# EasyEDA Pro project ProDocument_LN_CTRL_V1_2026-03-25.epro, schematic Schematic1, sheets 1 to 3 of 5

## Sheets
1 README: Create Date: 2025-09-18; Page Name: README; Project Name: 偏控器件; Schematic Name: Schematic1; Update Date: 2025-09-26; Company: 嘉立创EDA; Page Size: A4; Version: V1.0
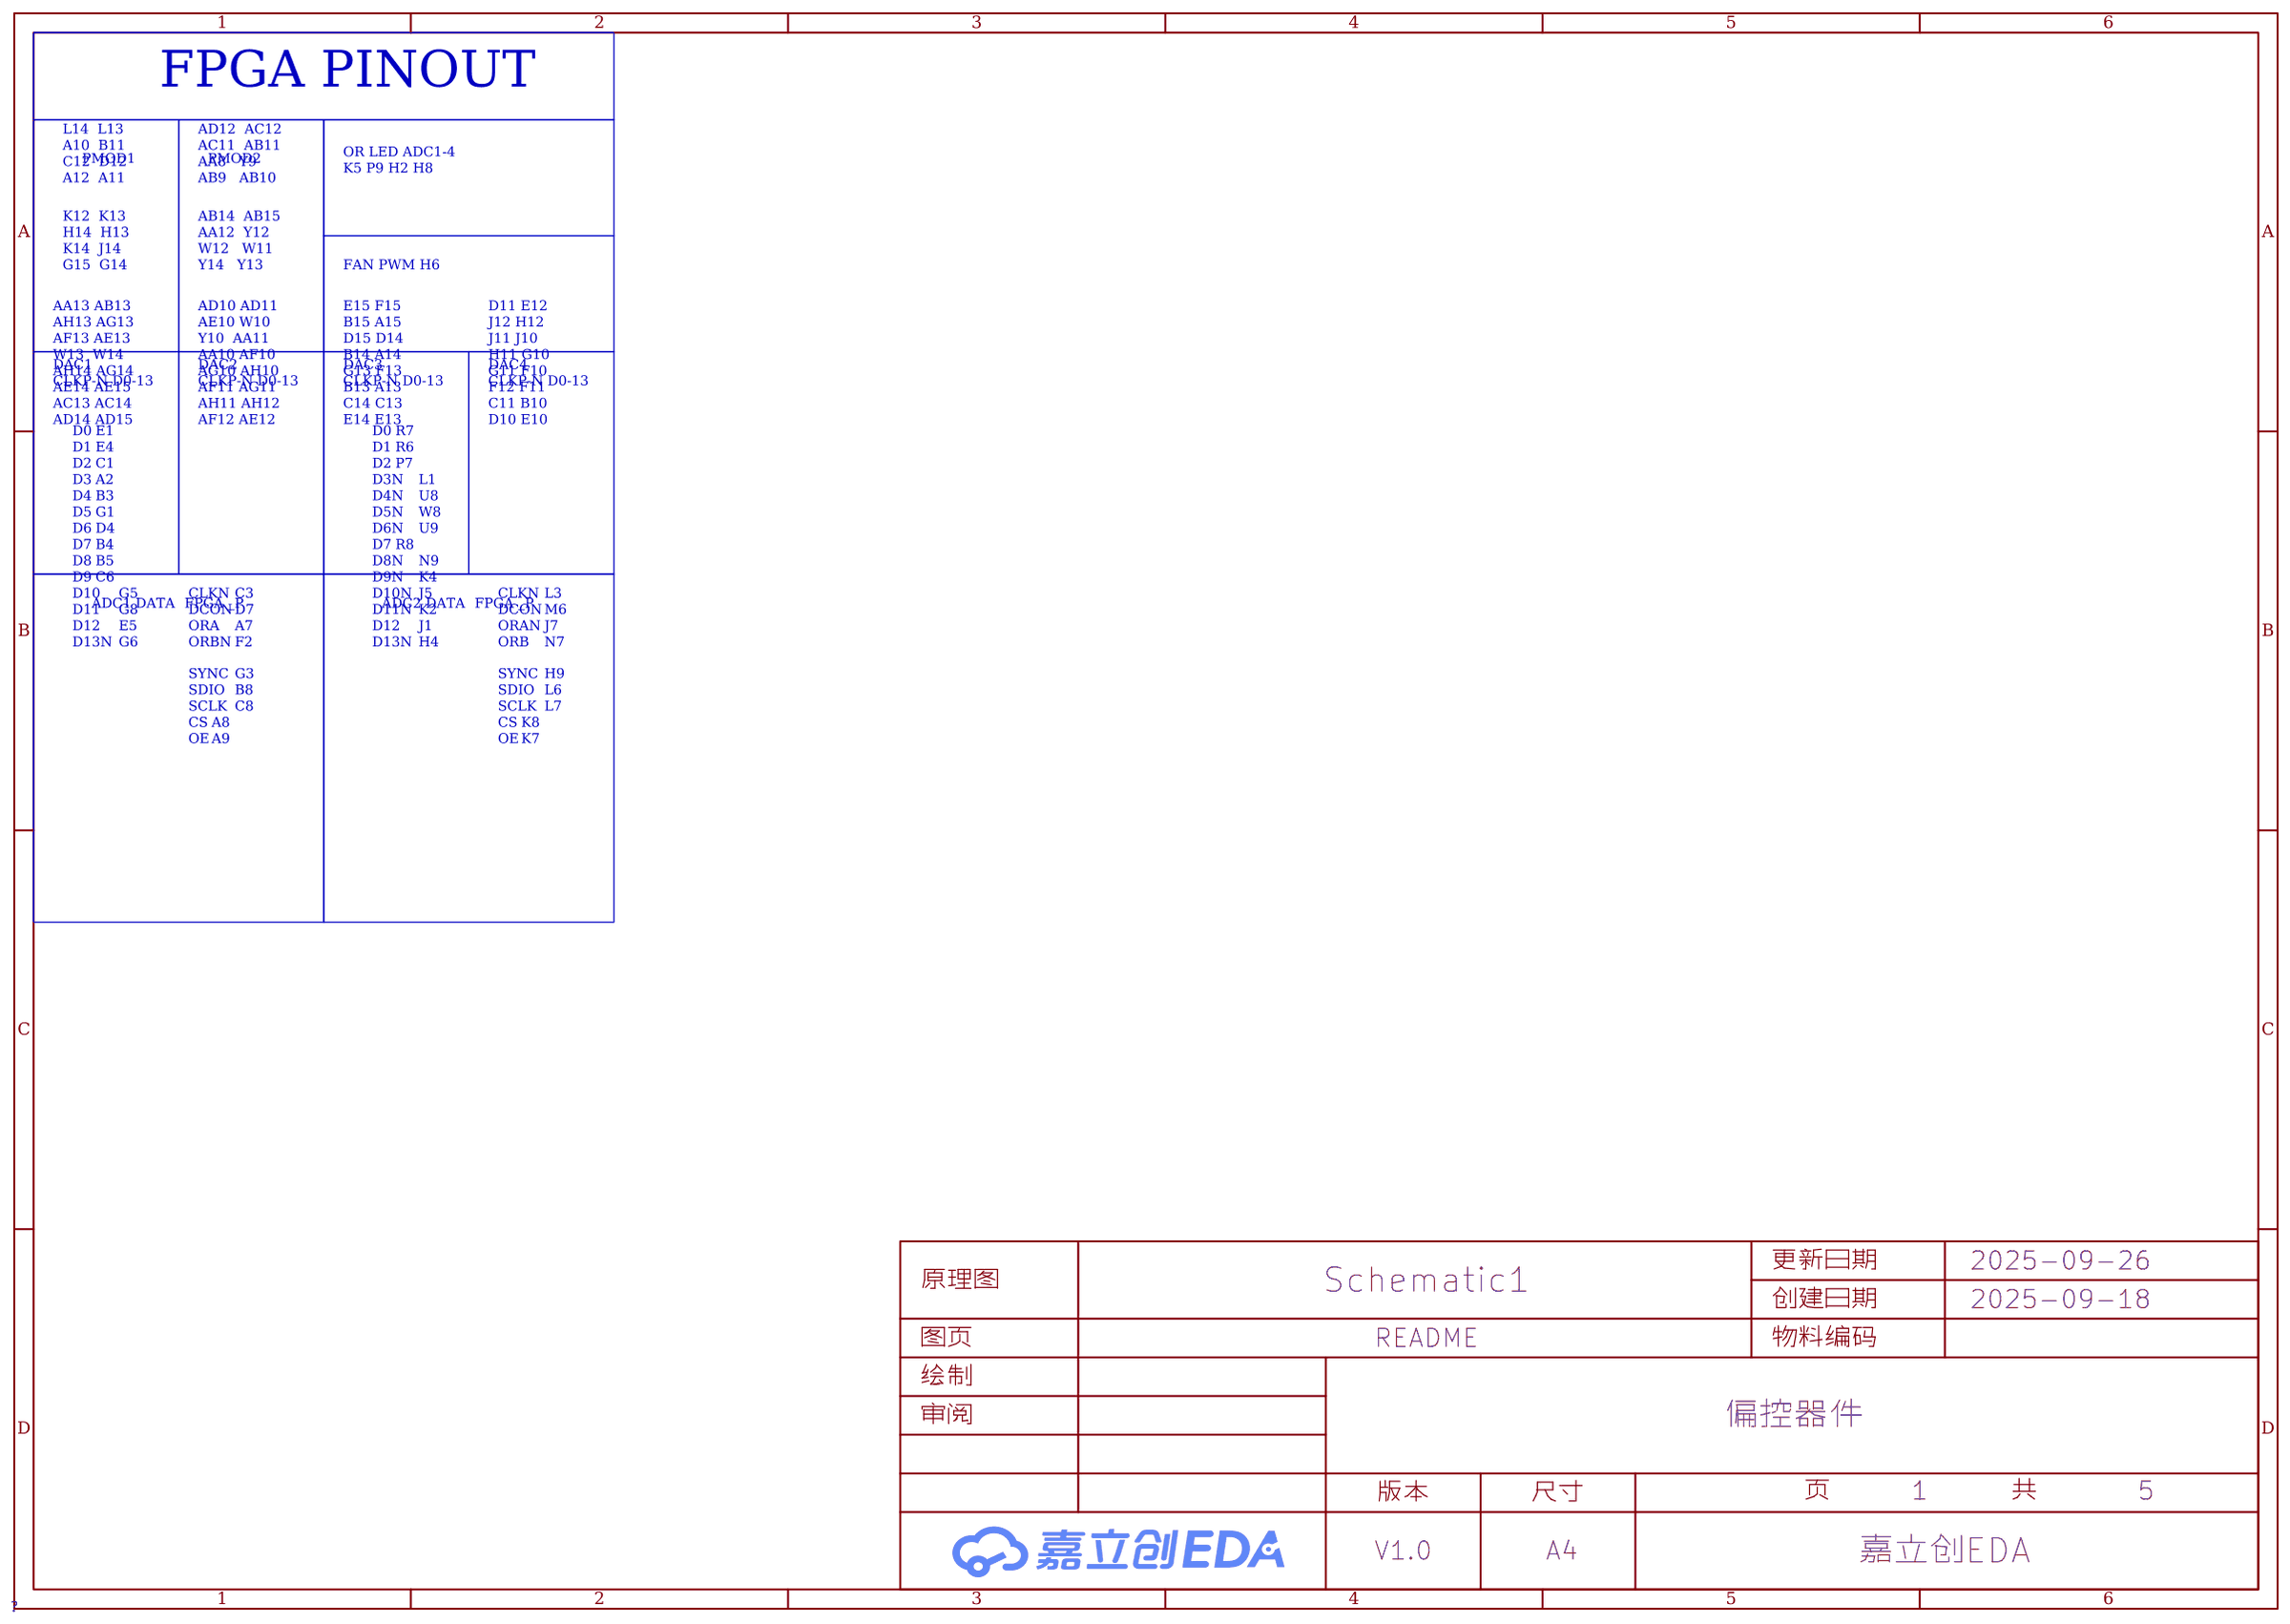
[diagram p0: README]
2 FPGA: Create Date: 2026-01-05; Page Name: FPGA; Project Name: ProDocument_LN_CTRL_V1; Update Date: 2026-01-05
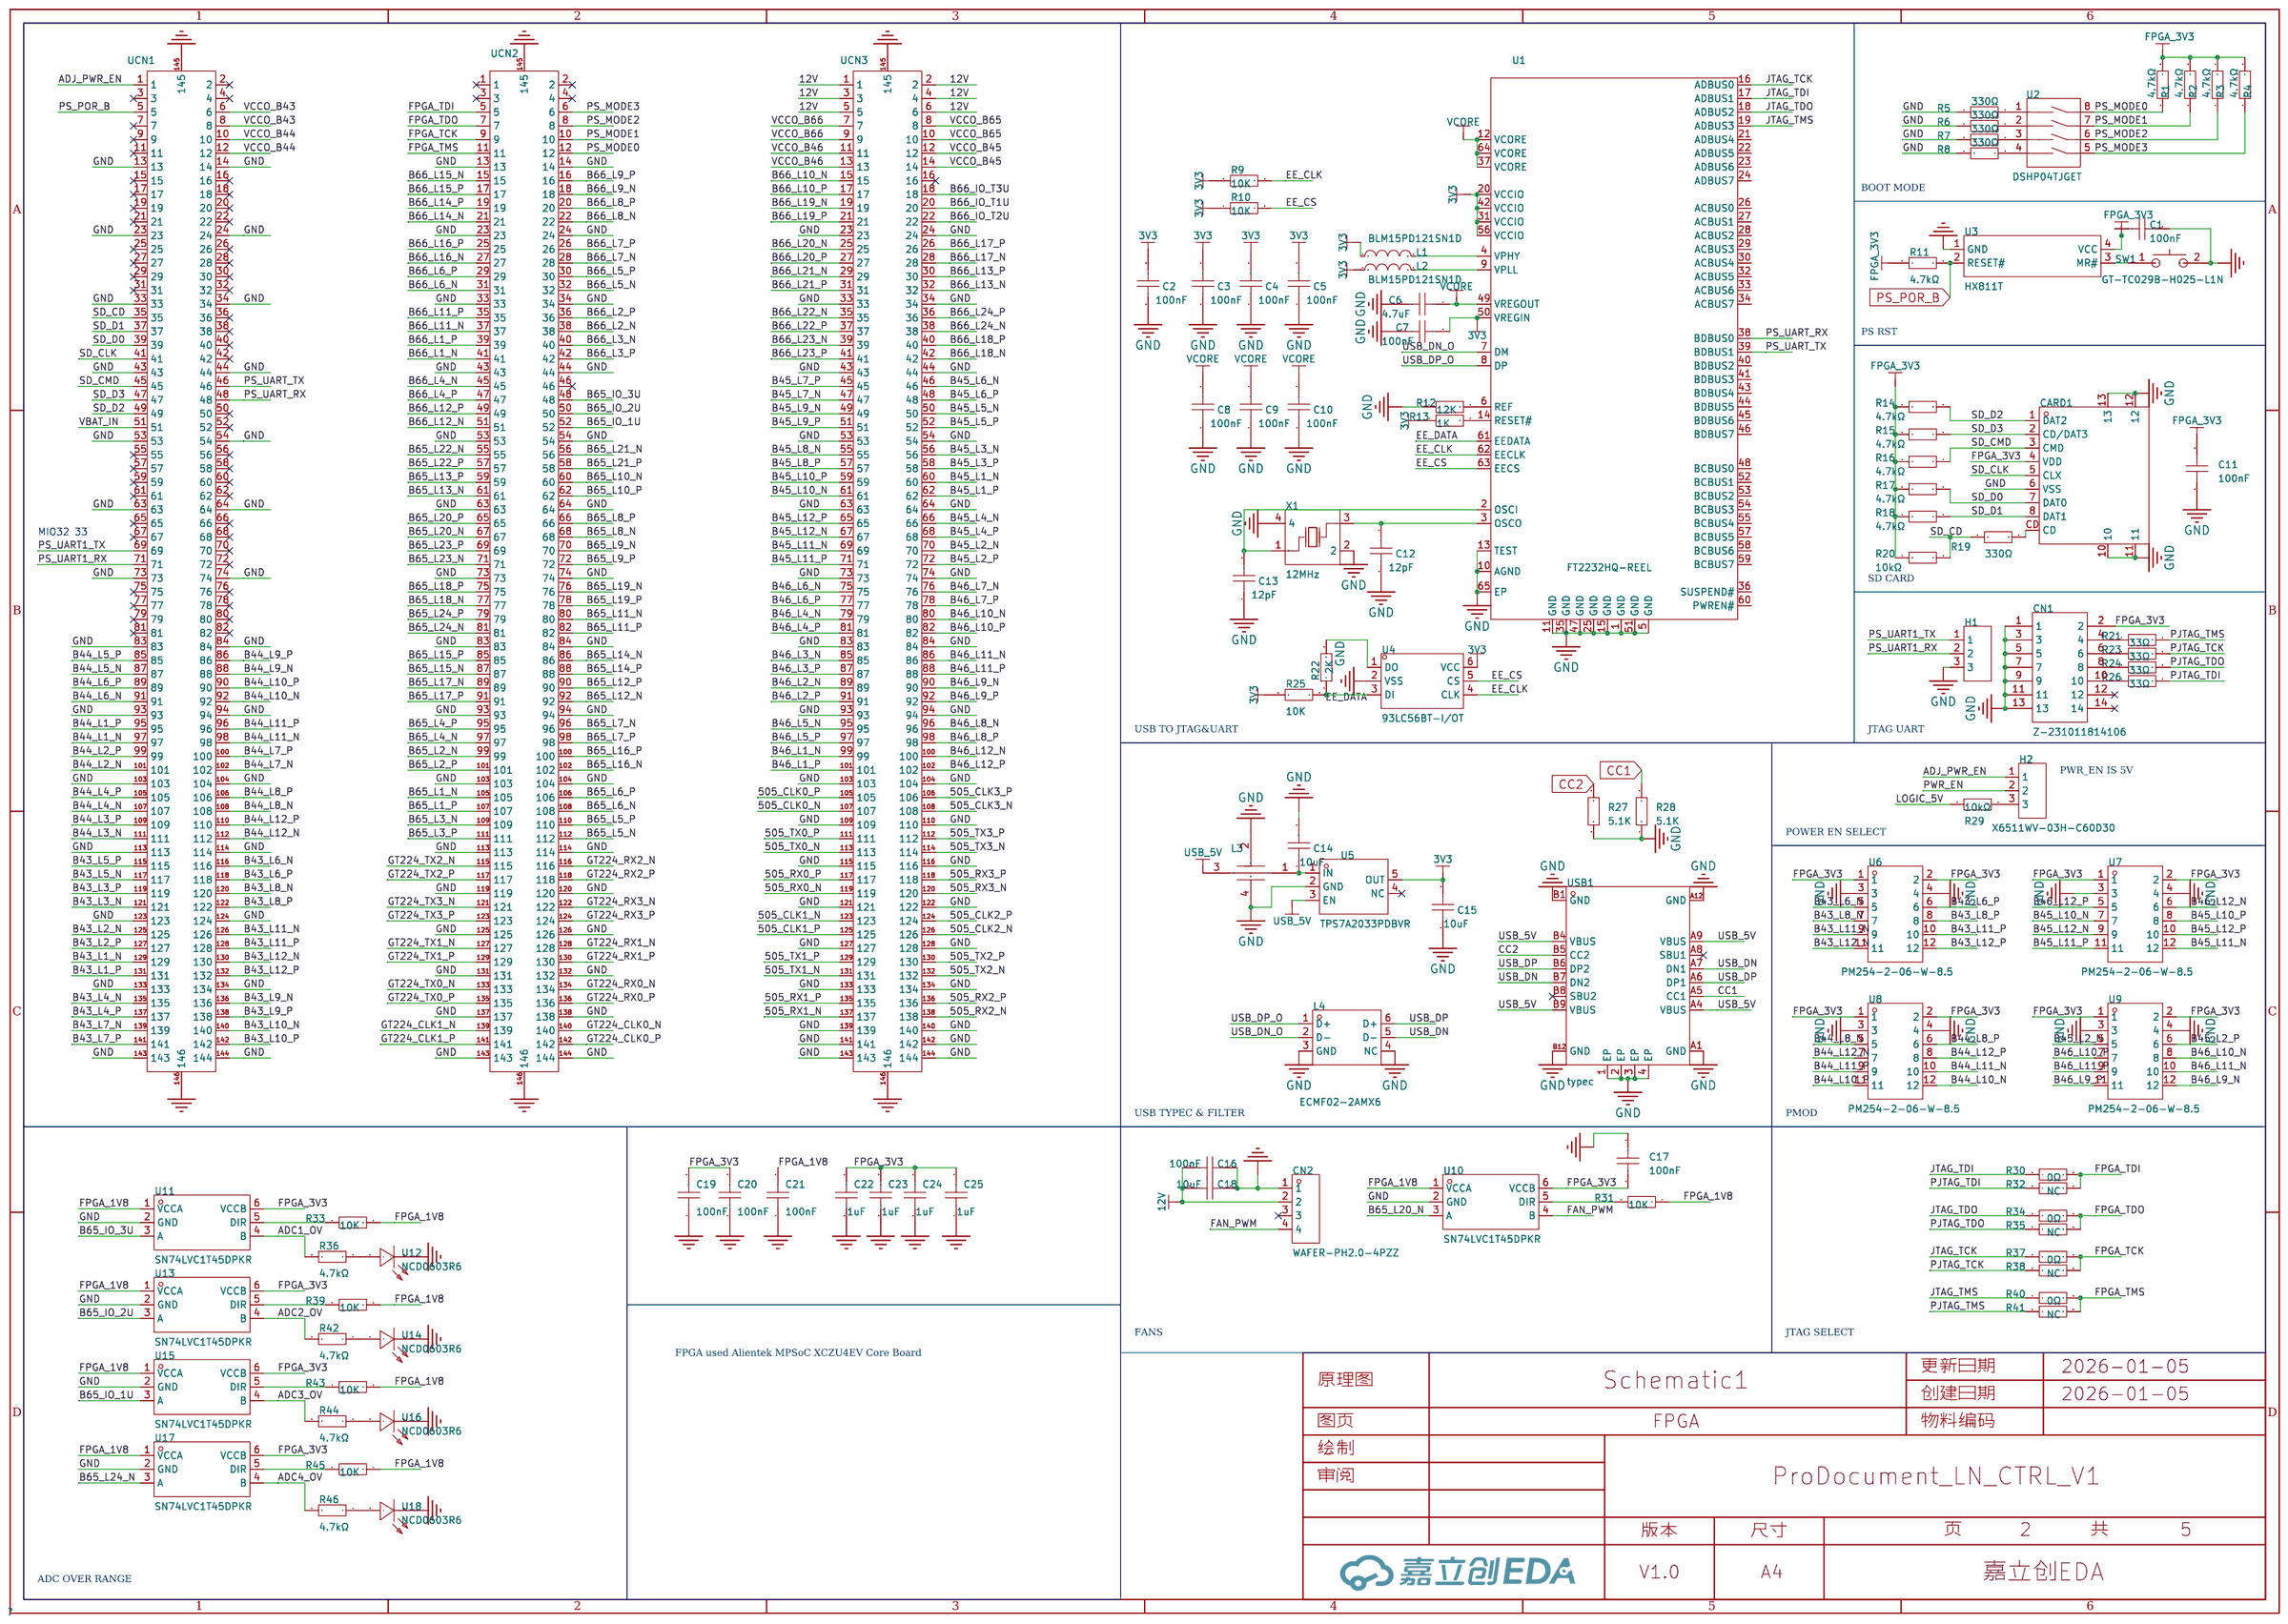
[diagram p1: FPGA]
3 DAC: Create Date: 2025-09-19; Page Name: DAC
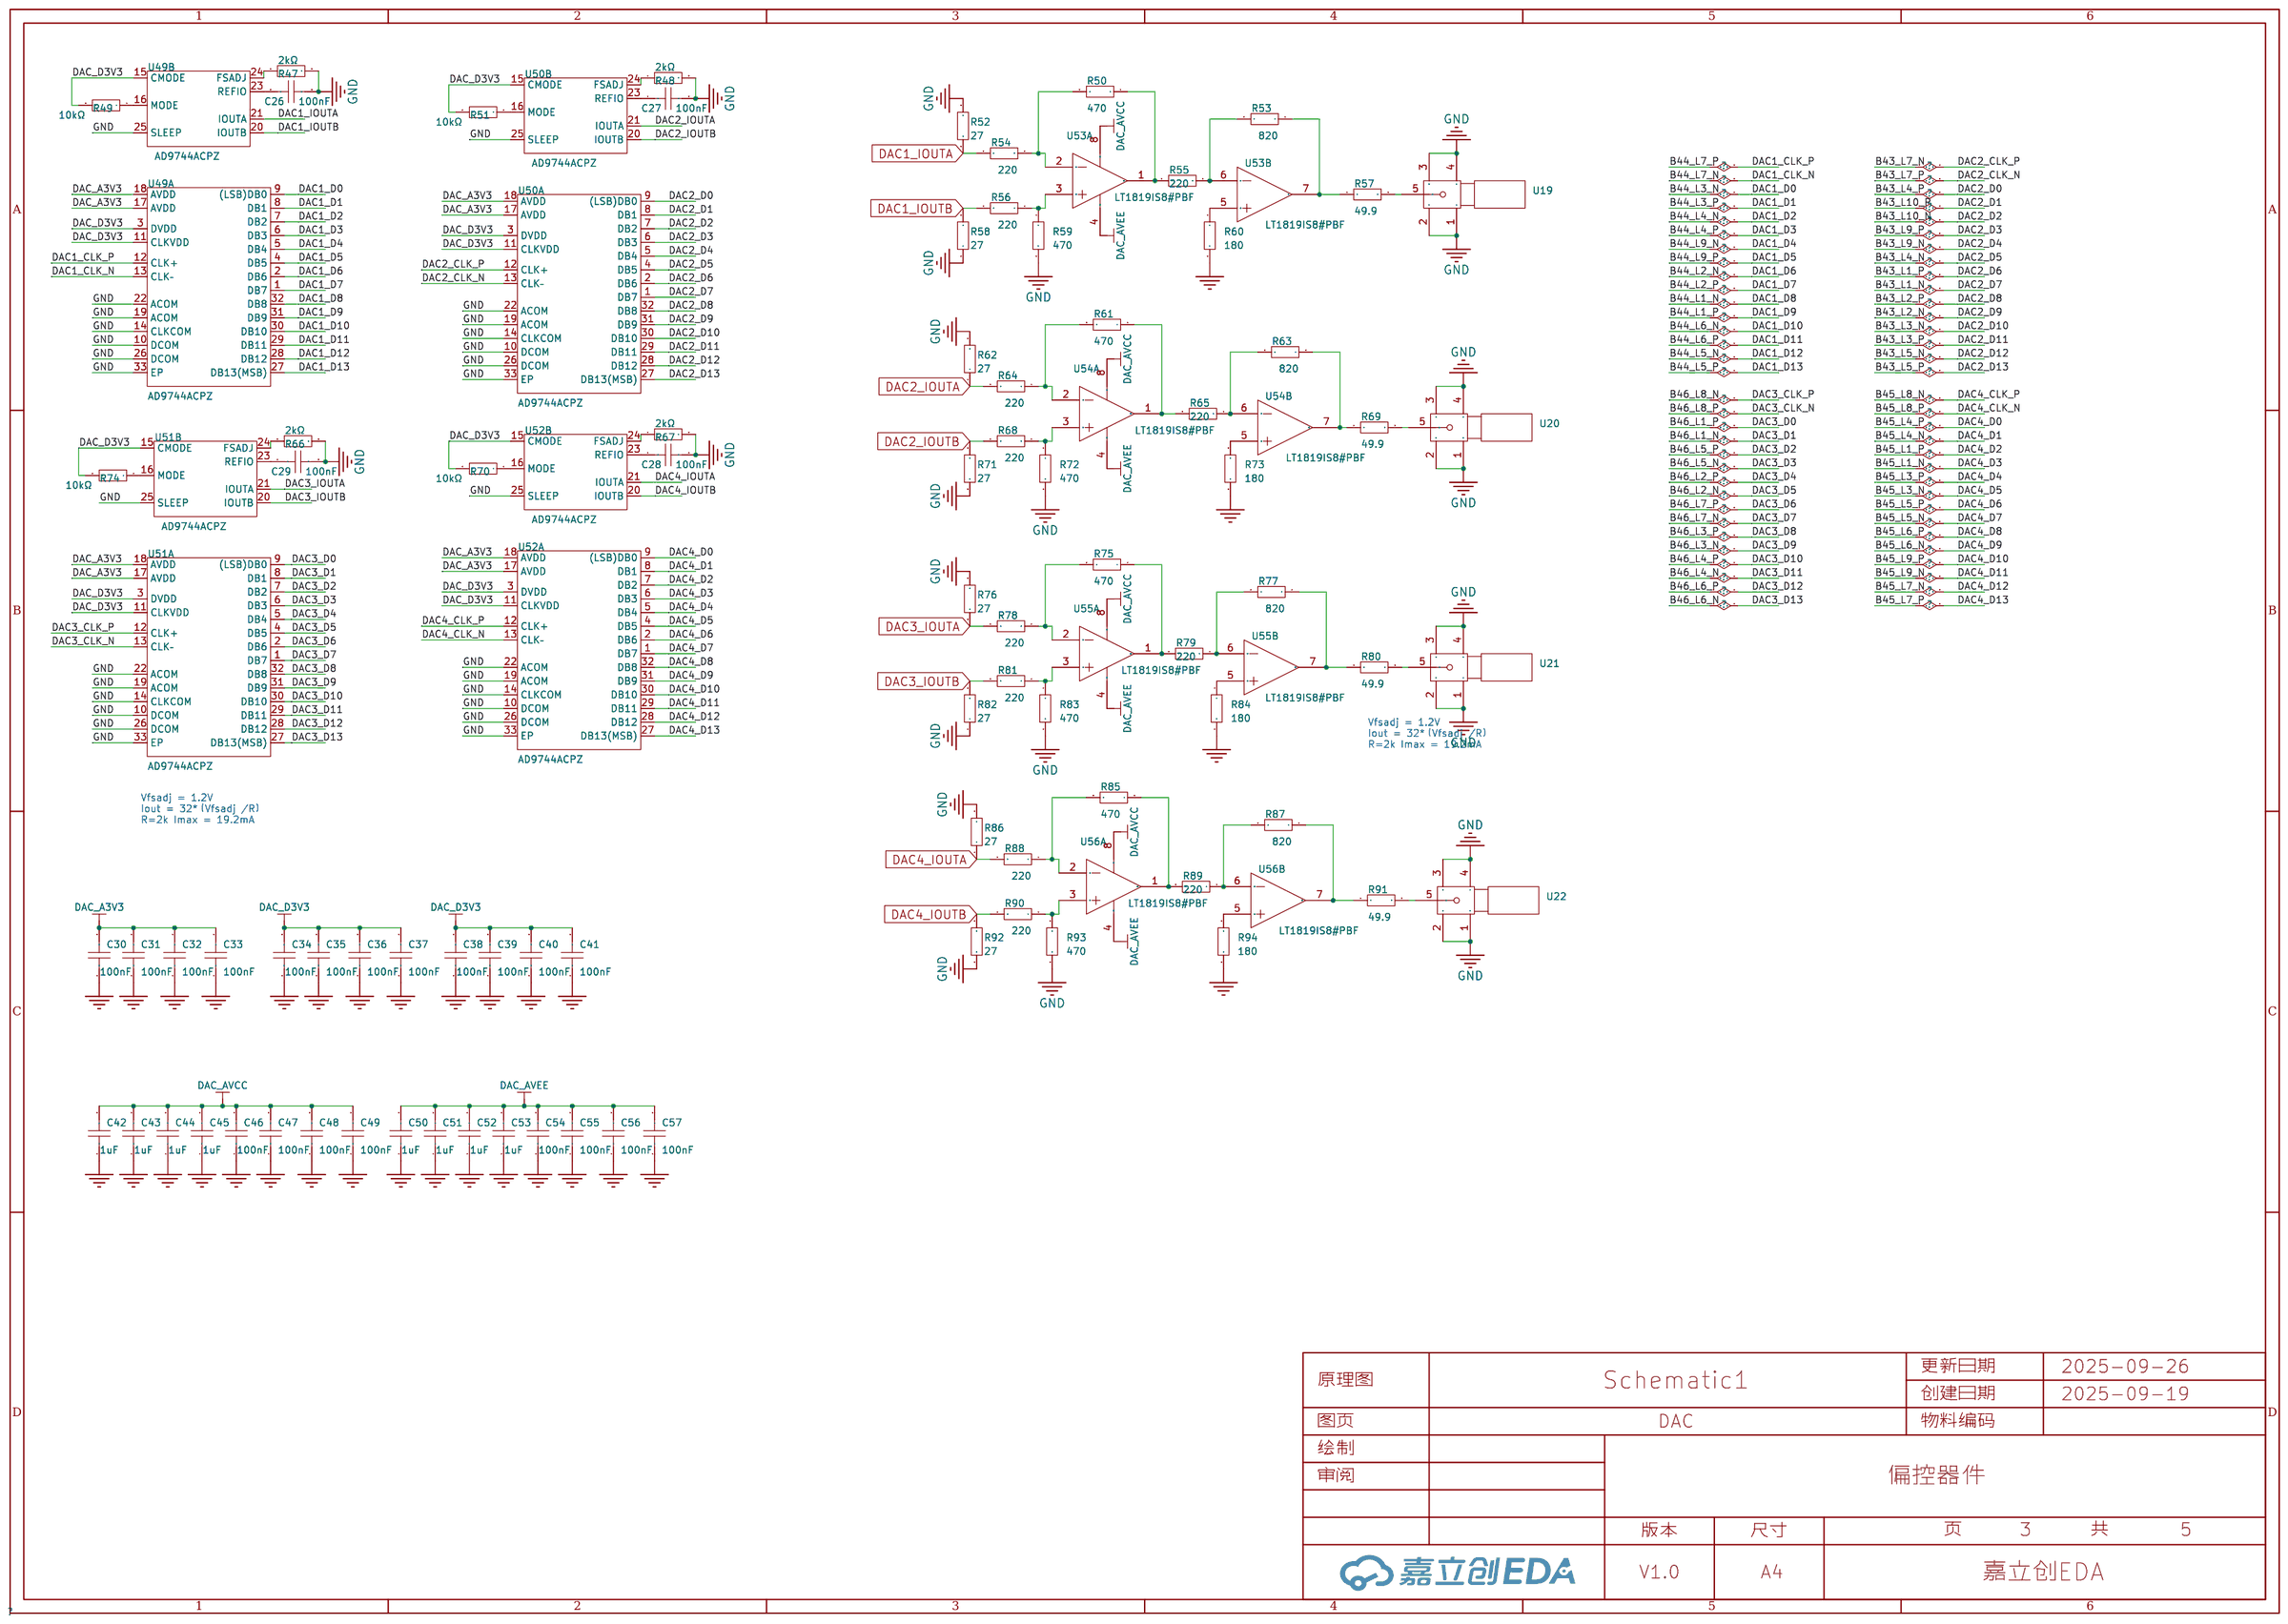
[diagram p2: DAC]

## Parts
sheet DAC
C26  100nF  [C0402]
C27  100nF  [C0402]
C28  100nF  [C0402]
C29  100nF  [C0402]
C30  100nF  [C0402]
C31  100nF  [C0402]
C32  100nF  [C0402]
C33  100nF  [C0402]
C34  100nF  [C0402]
C35  100nF  [C0402]
C36  100nF  [C0402]
C37  100nF  [C0402]
C38  100nF  [C0402]
C39  100nF  [C0402]
C40  100nF  [C0402]
C41  100nF  [C0402]
C42  1uF  [C0603]
C43  1uF  [C0603]
C44  1uF  [C0603]
C45  1uF  [C0603]
C46  100nF  [C0402]
C47  100nF  [C0402]
C48  100nF  [C0402]
C49  100nF  [C0402]
C50  1uF  [C0603]
C51  1uF  [C0603]
C52  1uF  [C0603]
C53  1uF  [C0603]
C54  100nF  [C0402]
C55  100nF  [C0402]
C56  100nF  [C0402]
C57  100nF  [C0402]
R47  2kΩ  [R0402]
R48  2kΩ  [R0402]
R49  10kΩ  [R0402]
R50  470  [R0402]
R51  10kΩ  [R0402]
R52  27  [R0402]
R53  820  [R0402]
R54  220  [R0402]
R55  220  [R0402]
R56  220  [R0402]
R57  49.9  [R0603]
R58  27  [R0402]
R59  470  [R0402]
R60  180  [R0402]
R61  470  [R0402]
R62  27  [R0402]
R63  820  [R0402]
R64  220  [R0402]
R65  220  [R0402]
R66  2kΩ  [R0402]
R67  2kΩ  [R0402]
R68  220  [R0402]
R69  49.9  [R0603]
R70  10kΩ  [R0402]
R71  27  [R0402]
R72  470  [R0402]
R73  180  [R0402]
R74  10kΩ  [R0402]
R75  470  [R0402]
R76  27  [R0402]
R77  820  [R0402]
R78  220  [R0402]
R79  220  [R0402]
R80  49.9  [R0603]
R81  220  [R0402]
R82  27  [R0402]
R83  470  [R0402]
R84  180  [R0402]
R85  470  [R0402]
R86  27  [R0402]
R87  820  [R0402]
R88  220  [R0402]
R89  220  [R0402]
R90  220  [R0402]
R91  49.9  [R0603]
R92  27  [R0402]
R93  470  [R0402]
R94  180  [R0402]
U19  -  [MOLEX_SMA]
U20  -  [MOLEX_SMA]
U21  -  [MOLEX_SMA]
U22  -  [MOLEX_SMA]
U49  AD9744ACPZ  [LFCSP-32_L5.0-W5.0-P0.50-TL-EP3.1]  (sections 1,2)
U50  AD9744ACPZ  [LFCSP-32_L5.0-W5.0-P0.50-TL-EP3.1]  (sections 1,2)
U51  AD9744ACPZ  [LFCSP-32_L5.0-W5.0-P0.50-TL-EP3.1]  (sections 1,2)
U52  AD9744ACPZ  [LFCSP-32_L5.0-W5.0-P0.50-TL-EP3.1]  (sections 1,2)
U53  LT1819IS8#PBF  [SOP-8_L5.0-W4.0-P1.27-LS6.0-BL]  (sections 1,2)
U54  LT1819IS8#PBF  [SOP-8_L5.0-W4.0-P1.27-LS6.0-BL]  (sections 1,2)
U55  LT1819IS8#PBF  [SOP-8_L5.0-W4.0-P1.27-LS6.0-BL]  (sections 1,2)
U56  LT1819IS8#PBF  [SOP-8_L5.0-W4.0-P1.27-LS6.0-BL]  (sections 1,2)
sheet FPGA
C1  100nF  [C0402]
C2  100nF  [C0402]
C3  100nF  [C0402]
C4  100nF  [C0402]
C5  100nF  [C0402]
C6  4.7uF  [C0402]
C7  100nF  [C0402]
C8  100nF  [C0402]
C9  100nF  [C0402]
C10  100nF  [C0402]
C11  100nF  [C0402]
C12  12pF  [C0402]
C13  12pF  [C0402]
C14  10uF  [C0603]
C15  10uF  [C0603]
C16  100nF  [C0402]
C17  100nF  [C0402]
C18  10uF  [C0805]
C19  100nF  [C0402]
C20  100nF  [C0402]
C21  100nF  [C0402]
C22  1uF  [C0603]
C23  1uF  [C0603]
C24  1uF  [C0603]
C25  1uF  [C0603]
CARD1  TF PUSH  [TF-SMD_TF-PUSH]
CN1  Z-231011814106  [IDC-TH_14P-P2.54-V-R2-C7-S2.54]
CN2  WAFER-PH2.0-4PZZ  [CONN-TH_4P-P2.00_FWF20001-S04S22W5B]
H1  X6511WV-03H-C60D30  [HDR-TH_3P-P2.54-V-M]
H2  X6511WV-03H-C60D30  [HDR-TH_3P-P2.54-V-M]
L1  BLM15PD121SN1D  [L0402]
L2  BLM15PD121SN1D  [L0402]
L3  NFM21PC104R1E3D  [CAP-SMD_4P-L2.0-W1.25]
L4  ECMF02-2AMX6  [UFQFN-6_L1.7-W1.5]
R1  4.7kΩ  [R0402]
R2  4.7kΩ  [R0402]
R3  4.7kΩ  [R0402]
R4  4.7kΩ  [R0402]
R5  330Ω  [R0402]
R6  330Ω  [R0402]
R7  330Ω  [R0402]
R8  330Ω  [R0402]
R9  10K  [R0402]
R10  10K  [R0402]
R11  4.7kΩ  [R0402]
R12  12K  [R0402]
R13  1K  [R0402]
R14  4.7kΩ  [R0402]
R15  4.7kΩ  [R0402]
R16  4.7kΩ  [R0402]
R17  4.7kΩ  [R0402]
R18  4.7kΩ  [R0402]
R19  330Ω  [R0402]
R20  10kΩ  [R0402]
R21  33Ω  [R0402]
R22  2K  [R0402]
R23  33Ω  [R0402]
R24  33Ω  [R0402]
R25  10K  [R0402]
R26  33Ω  [R0402]
R27  5.1K  [R0402]
R28  5.1K  [R0402]
R29  10kΩ  [R0402]
R30  0Ω  [R0402]
R31  10K  [R0402]
R32  NC  [R0402]
R33  10K  [R0402]
R34  0Ω  [R0402]
R35  NC  [R0402]
R36  4.7kΩ  [R0402]
R37  0Ω  [R0402]
R38  NC  [R0402]
R39  10K  [R0402]
R40  0Ω  [R0402]
R41  NC  [R0402]
R42  4.7kΩ  [R0402]
R43  10K  [R0402]
R44  4.7kΩ  [R0402]
R45  10K  [R0402]
R46  4.7kΩ  [R0402]
SW1  GT-TC029B-H025-L1N  [SW-SMD_L3.9-W3.0-P4.45]
U1  FT2232HQ-REEL  [QFN-64_L9.0-W9.0-P0.50-TL-EP4.3]
U2  DSHP04TJGET  [SW-SMD_8P-L6.7-W5.4-P1.27-LS5.6]
U3  HX811T  [SOT-143_L2.9-W1.3-P1.92-LS2.3-BL]
U4  93LC56BT-I/OT  [SOT-23-6_L2.9-W1.6-P0.95-LS2.8-BR]
U5  TPS7A2033PDBVR  [SOT-23-5_L2.9-W1.6-P0.95-LS2.8-BR]
U6  PM254-2-06-W-8.5  [HDR-TH_12P-P2.54-H-F-R2-C6-W8.5]
U7  PM254-2-06-W-8.5  [HDR-TH_12P-P2.54-H-F-R2-C6-W8.5]
U8  PM254-2-06-W-8.5  [HDR-TH_12P-P2.54-H-F-R2-C6-W8.5]
U9  PM254-2-06-W-8.5  [HDR-TH_12P-P2.54-H-F-R2-C6-W8.5]
U10  SN74LVC1T45DPKR  [USON-6_L1.6-W1.6-P0.50-BL]
U11  SN74LVC1T45DPKR  [USON-6_L1.6-W1.6-P0.50-BL]
U12  NCD0603R6  [LED0603-RD]
U13  SN74LVC1T45DPKR  [USON-6_L1.6-W1.6-P0.50-BL]
U14  NCD0603R6  [LED0603-RD]
U15  SN74LVC1T45DPKR  [USON-6_L1.6-W1.6-P0.50-BL]
U16  NCD0603R6  [LED0603-RD]
U17  SN74LVC1T45DPKR  [USON-6_L1.6-W1.6-P0.50-BL]
U18  NCD0603R6  [LED0603-RD]
UCN1  -  [FX10A-144S-SV]
UCN2  -  [FX10A-144S-SV]
UCN3  -  [FX10A-144S-SV]
USB1  typec  [USB-C-SMD_KH-TYPE-C-16P]
X1  12MHz  [OSC-SMD_4P-L2.5-W2.0-BL]

## Library data of the parts
C1 C11 C16 C17 C19-C21 C26-C41 C46-C49 C54-C57 = GRM155R71H104KE14D: 容值:100nF;精度:±10%;额定电压:50V;材质(温度系数):X7R;; LCSC Part Name: 100nF ±10% 50V; Supplier Part: C77020; Manufacturer: muRata(村田); Supplier Footprint: 0402; JLCPCB Part Class: 扩展库; Datasheet: https://atta.szlcsc.com/upload/public/pdf/source/20180326/C77020_39BD49C951FF1AF0DB1F1FAC5AC1E401.pdf; Supplier: LCSC; Tolerance: ±10%; Voltage Rated: 50V; Temperature Coefficient: X7R
C22-C25 C42-C45 C50-C53 = CC0603KRX7R9BB105: 容值:1uF;精度:±10%;额定电压:50V;温度系数:X7R;; LCSC Part Name: 1uF ±10% 50V; Supplier Part: C559769; Manufacturer: YAGEO(国巨); Supplier Footprint: 0603; JLCPCB Part Class: 扩展库; Datasheet: https://item.szlcsc.com/datasheet/CC0603KRX7R9BB105/584032.html; Supplier: LCSC; Tolerance: ±10%; Voltage Rating: 50V; Temperature Coefficient: X7R
R47-R49 R51 R66 R67 R70 R74 = 0402WGF1001TCE: 电阻类型:厚膜电阻;阻值:1kΩ;精度:±1%;功率:62.5mW;; LCSC Part Name: 1kΩ ±1% 62.5mW; Supplier Part: C11702; Manufacturer: UNI-ROYAL(厚声); Supplier Footprint: 0402; JLCPCB Part Class: Basic Part; Datasheet: https://atta.szlcsc.com/upload/public/pdf/source/20200306/C422600_1E6D84923E4A46A82E41ADD87F860B5C.pdf; Supplier: LCSC; Type: 厚膜电阻; Tolerance: ±1%; Power(Watts): 62.5mW; Temperature Coefficient: ±100ppm/℃; Overload Voltage (Max): 50V; Operating Temperature Range: -55℃~+155℃
R9 R10 R12 R13 R22 R25 R27 R28 R31 R33 R39 R43 R45 R50 R52-R56 R58-R65 R68 R71-R73 R75-R79 R81-R90 R92-R94 = Res_0402: Supplier Footprint: 0402
R57 R69 R80 R91 = Res_0603: Supplier Footprint: 0603
U19-U22 = MOLEX_SMA: C296128
U49-U52 = AD9744ACPZ: 接口:并行;分辨率:14位;稳定时间:11ns;INL/DNL:±0.5LSB；±0.8LSB;电源电压:2.7V~3.6V;; Supplier: LCSC; Supplier Part: C653767; Manufacturer: ADI(亚德诺); JLCPCB Part Class: 扩展库; Supplier Footprint: LFCSP-32; Datasheet: https://atta.szlcsc.com/upload/public/pdf/source/20191122/C461519_0CE66F4EB669333EDB67C039F6406F90.pdf; Interface: 并行; Resolution: 14位; Output Type: 电流-非缓冲; Settling Time: 11ns; Integral nonlinearity: ±0.5LSB；±0.8LSB; Supply Voltage: 2.7V~3.6V; Operating Temperature: -40℃~+85℃
U53-U56 = LT1819IS8#PBF: 放大器数:双路;轨到轨:-;增益带宽积(GBP):400MHz;输入失调电压(Vos):1.5mV;压摆率(SR):2500V/us;输入偏置电流(Ib):2uA;; LCSC Part Name: 400MHz、2500V/us、9mA 双通道运算放大器; Supplier Part: C665487; Manufacturer: ADI(亚德诺); Supplier Footprint: SOP-8; JLCPCB Part Class: 扩展库; Datasheet: https://atta.szlcsc.com/upload/public/pdf/source/20200629/C665474_545359778D1078CAA837BDA2F2E5E456.pdf; Supplier: LCSC; Number of Circuits: 双路; Maximum Power Supply Range (Vdd-Vss): 10V; Gain Bandwidth Product(GBP): 400MHz; Voltage - Input Offset(Vos): 1.5mV; Input Offset Voltage Drift (Vos TC): 30uV/℃; Slew Rate(SR): 2500V/us; Current - Input Bias(Ib): 2uA; Noise density(eN): 6nV/√Hz@10kHz; Common Mode Rejection Ratio (CMRR): 85dB; Output Current: 70mA; Operating Temperature: -40℃~+85℃
C2-C10 C12 C13 = CAP_0402: Supplier Footprint: 0402
C14 C15 = GRM188Z71A106KA73D: 容值:10uF;精度:±10%;额定电压:10V;材质(温度系数):X7R;; LCSC Part Name: 10uF ±10% 10V; Supplier Part: C2959727; Manufacturer: muRata(村田); Supplier Footprint: 0603; JLCPCB Part Class: 扩展库; Datasheet: https://atta.szlcsc.com/upload/public/pdf/source/20220328/6A4892B7E841253269A84FFE395E0578.pdf; Supplier: LCSC; Tolerance: ±10%; Voltage Rated: 10V; Temperature Coefficient: X7R
C18 = GRM21BR61H106KE43L: 容值:10uF;精度:±10%;额定电压:50V;材质(温度系数):X5R;; LCSC Part Name: 10uF ±10% 50V; Supplier Part: C440198; Manufacturer: muRata(村田); Supplier Footprint: 0805; JLCPCB Part Class: 基础库; Datasheet: https://atta.szlcsc.com/upload/public/pdf/source/20230811/95AAE0C9AF55EDC31B7A4D8B733F534E.pdf; Supplier: LCSC; Tolerance: ±10%; Voltage Rated: 50V; Temperature Coefficient: X5R
CARD1 = TF PUSH: 卡连接方式:自弹式;卡类型:MicroSD卡(TF卡);连接器类型:卡座;本体最大高度:2mm;工作温度范围:-20℃~+90℃;; LCSC Part Name: 自弹式 MicroSD卡(TF卡) 卡座; Supplier Part: C393941; Manufacturer: SHOU HAN(首韩); Supplier Footprint: SMD; JLCPCB Part Class: 扩展库; Datasheet: https://atta.szlcsc.com/upload/public/pdf/source/20191011/C393941_0DDD896EE907FEB750D8B7B8982E2A67.pdf; Supplier: LCSC; Card Connection Mode: 自弹式; Card Type: MicroSD卡(TF卡); Connector Type: 卡座; Maximum Body Height: 2mm; Operating Temperature Range: -20℃~+90℃
CN1 = Z-231011814106: 连接器类型:简牛座;间距:2.54mm;结构:2x7P;安装方式:直插;行距:2.54mm;排数:2;每排PIN数:7;触头材质:黄铜;触头镀层:金;; LCSC Part Name: 2.54mm 2x7P 排数:2 每排P数:7; Supplier Part: C93702; Manufacturer: Nextron(正凌); Supplier Footprint: 插件,P=2.54mm; JLCPCB Part Class: 扩展库; Datasheet: https://item.szlcsc.com/datasheet/Z-231011814106/94900.html; Supplier: LCSC; Connector Type: 简牛座; Pitch: 2.54mm; Number of Positions or Pins: 2x7P; Holder Type: 直插; Row Spacing: 2.54mm; Number of Rows: 2; Number of PINs Per Row: 7; Contact Material: 黄铜; Contact Plating: 金
CN2 = WAFER-PH2.0-4PZZ: 插针结构:1x4P;间距:2mm;安装方式:直插;参考系列:PH;总PIN数:4P;排数:1;每排PIN数:4;行距:-;额定电流:2A;触头材质:黄铜;触头镀层:锡;工作温度:-25℃~+85℃;; LCSC Part Name: 1x4P 间距:2mm 直插 系列:PH; Supplier Part: C5359601; Manufacturer: XUNPU(讯普); Supplier Footprint: 插件,P=2mm; JLCPCB Part Class: 扩展库; Datasheet: https://item.szlcsc.com/datasheet/WAFER-PH2.0-4PZZ/6173837.html; Supplier: LCSC; Pins Structure: 1x4P; Pitch: 2mm; Mounting Type: 直插; Reference Series: PH; Number of Pins: 4P; Number of Rows: 1; Number of PINs Per Row: 4; Current Rating: 2A; Contact Material: 黄铜; Contact Plating: 锡; Operating Temperature: -25℃~+85℃; Voltage Rating: 250V; Plastic Material: PA66; Flame Retardant Rating: UL94V-0; Color: 白色; Z-Height of the Board: 6.05mm; X-Length of Bottom Edge on Board (Spacing Line): 10mm; Y-Width of Bottom Edge on Board: 4.7mm
H1 H2 = X6511WV-03H-C60D30: 插针结构:1x3P;间距:2.54mm;行距:-;圆针/方针:方针;排数:单排;总PIN位数:3P;额定电流:3A;额定电压:250V;配合针长度:-;塑高:2.5mm;端接针长度:-;触头材质:黄铜;触头镀层:金;工作温度:-40℃~+105℃;颜色:黑色;; LCSC Part Name: 1x3P 间距:2.54mm 方针; Supplier Part: C706875; Manufacturer: XKB Connection(中国星坤); Supplier Footprint: 插件,P=2.54mm; JLCPCB Part Class: 扩展库; Datasheet: https://item.szlcsc.com/datasheet/X6511WV-03H-C60D30/743997.html; Supplier: LCSC; Pin Structure: 1x3P; Pitch: 2.54mm; Circluar Pins/Square Pins: 方针; Number of Rows: 单排; Number of Pins: 3P; Current Rating: 3A; Voltage Rating (Max): 250V; Insulation Height: 2.5mm; Contact Material: 黄铜; Contact Plating: 金; Operating Temperature: -40℃~+105℃; Color: 黑色
L1 L2 = BLM15PD121SN1D: 标称阻抗@测试频率:120Ω@100MHz;误差:±25%;直流电阻(RDC):90mΩ;; LCSC Part Name: 单路 0402磁珠 阻抗120Ω@100MHz; Supplier Part: C76891; Manufacturer: muRata(村田); Supplier Footprint: 0402; Datasheet: https://atta.szlcsc.com/upload/public/pdf/source/20180326/C76891_C89C2C1119D9992B67A2515C9BBB882D.pdf; Supplier: LCSC; Impedance @ Frequency: 120Ω@100MHz; Tolerance: ±25%; DC Resistance: 90mΩ; Current Rating: 1.3A; Circuits: 1
L3 = NFM21PC104R1E3D: 电容量:100nF;精度:±20%;直流电阻:30mΩ;; LCSC Part Name: 100nF(104) ±20% 25V; Supplier Part: C86150; Manufacturer: muRata(村田); Supplier Footprint: 0805; JLCPCB Part Class: 扩展库; Datasheet: https://atta.szlcsc.com/upload/public/pdf/source/20180326/C86150_E4B7366323682FA84DED9003C68CA797.pdf; Supplier: LCSC; Nominal Capacitance: 100nF; CapacitanceTolerance: ±20%; DC Rated Voltage: 25V; Rated Current: 2A; DC Resistance: 30mΩ; Operating Temperature: -55℃~+125℃
L4 = ECMF02-2AMX6: 线路数:2;直流电阻(DCR):2.5Ω;; Supplier Part: C2651144; Manufacturer: ST(意法半导体); Supplier Footprint: UFQFN-6(1.5x1.7); JLCPCB Part Class: 扩展库; Datasheet: https://atta.szlcsc.com/upload/public/pdf/source/20210702/5ABAEB64ABBB5666ADAF5B85EB7C19E4.pdf; Supplier: LCSC; Number of Lines: 2; Current Rating: 200mA; DC Resistance (DCR): 2.5Ω; Operating Temperature: -40℃~+85℃
R1-R4 R11 R14-R18 R20 R29 R36 R42 R44 R46 = 0402WGF4701TCE: 电阻类型:厚膜电阻;阻值:4.7kΩ;精度:±1%;功率:62.5mW;工作电压:50V;温度系数:±100ppm/℃;; LCSC Part Name: 4.7kΩ ±1% 62.5mW 厚膜电阻; Supplier Part: C25900; Manufacturer: UNI-ROYAL(厚声); Supplier Footprint: 0402; JLCPCB Part Class: 基础库; Datasheet: https://item.szlcsc.com/datasheet/0402WGF4701TCE/26643.html; Supplier: LCSC; Type: 厚膜电阻; Tolerance: ±1%; Power(Watts): 62.5mW; Voltage-Supply(Max): 50V; Temperature Coefficient: ±100ppm/℃; Operating Temperature: -55℃~+155℃
R5-R8 R19 = 0402WGF3300TCE: 电阻类型:厚膜电阻;阻值:330Ω;精度:±1%;功率:62.5mW;工作电压:50V;温度系数:±100ppm/℃;; LCSC Part Name: 330Ω ±1% 62.5mW 厚膜电阻; Supplier Part: C25104; Manufacturer: UNI-ROYAL(厚声); Supplier Footprint: 0402; JLCPCB Part Class: 基础库; Datasheet: https://item.szlcsc.com/datasheet/0402WGF3300TCE/25847.html; Supplier: LCSC; Type: 厚膜电阻; Tolerance: ±1%; Power(Watts): 62.5mW; Voltage-Supply(Max): 50V; Temperature Coefficient: ±100ppm/℃; Operating Temperature: -55℃~+155℃
R21 R23 R24 R26 = 0402WGF330JTCE: 电阻类型:厚膜电阻;阻值:33Ω;精度:±1%;功率:62.5mW;工作电压:50V;温度系数:±100ppm/℃;; LCSC Part Name: 33Ω ±1% 62.5mW 厚膜电阻; Supplier Part: C25105; Manufacturer: UNI-ROYAL(厚声); Supplier Footprint: 0402; JLCPCB Part Class: 基础库; Datasheet: https://item.szlcsc.com/datasheet/0402WGF330JTCE/25848.html; Supplier: LCSC; Type: 厚膜电阻; Tolerance: ±1%; Power(Watts): 62.5mW; Voltage-Supply(Max): 50V; Temperature Coefficient: ±100ppm/℃; Operating Temperature: -55℃~+155℃
R30 R32 R34 R35 R37 R38 R40 R41 = 0402WGF0000TCE: 电阻类型:厚膜电阻;阻值:0Ω;精度:±1%;功率:62.5mW;工作电压:50V;温度系数:±800ppm/℃;; LCSC Part Name: 0Ω ±1% 62.5mW 厚膜电阻; Supplier Part: C17168; Manufacturer: UNI-ROYAL(厚声); Supplier Footprint: 0402; JLCPCB Part Class: 基础库; Datasheet: https://item.szlcsc.com/datasheet/0402WGF0000TCE/17853.html; Supplier: LCSC; Type: 厚膜电阻; Tolerance: ±1%; Power(Watts): 62.5mW; Voltage-Supply(Max): 50V; Temperature Coefficient: ±800ppm/℃; Operating Temperature: -55℃~+155℃
SW1 = GT-TC029B-H025-L1N: 电路结构:单刀单掷;按钮形状:圆形按钮;作用力:2.5N;安装方式:立贴;开关长度:3.9mm;开关宽度:2.9mm;开关高度:2.5mm;带支架:不带;触点电流:50mA;额定电压(DC):12V;绝缘电阻:100MΩ;带灯:无;机械寿命:10万次;; LCSC Part Name: 3.9*2.9*2.5mm 立贴 轻触开关; Supplier Part: C843669; Manufacturer: G-Switch(品赞); Supplier Footprint: SMD; JLCPCB Part Class: 扩展库; Datasheet: https://atta.szlcsc.com/upload/public/pdf/source/20231124/9839E728E86EAB127AE2541ED475D299.pdf; Supplier: LCSC; Circuit: 单刀单掷; Actuator Style: 圆形按钮; Operating Force: 2.5N; Mounting Style: 立贴; Switch Length: 3.9mm; Switch Width: 2.9mm; Switch Height: 2.5mm; Strike Gundam: 不带; Contact Current: 50mA; Voltage Rating (DC): 12V; Insulation Resistance: 100MΩ; Actuator/Cap Color: 黑色; With Lamp: 无; Pin Style: SMD接片; Mechanical Life: 10万次; Operating Temperature: -30℃~+85℃
U1 = FT2232HQ-REEL: 应用功能:USB转UART；USB转FIFO;接口协议:UART;供电电压:3V~3.6V;; Supplier Part: C193662; Manufacturer: FTDI(飞特帝亚); Supplier Footprint: QFN-64-EP(9x9); JLCPCB Part Class: 扩展库; Datasheet: https://atta.szlcsc.com/upload/public/pdf/source/20180530/C193662_F14B45A4B5271BE746E436B0F2E041EE.pdf; Supplier: LCSC; Applications Function: USB转UART；USB转FIFO; Protocol: UART; Supply Voltage: 3V~3.6V; Operating Temperature: -40℃~+85℃
U2 = DSHP04TJGET: 类型:平拨,凹槽式;电路结构:单刀单掷;开关位数:4位;额定电流:25mA;额定电压:24V;工作寿命:3千次;颜色:黑色;; LCSC Part Name: 1.27mm 4位贴片拨码开关(J脚); Supplier Part: C5144955; Manufacturer: KE(广督); Supplier Footprint: SMD-8P,5.4x6.6mm; JLCPCB Part Class: 扩展库; Datasheet: https://item.szlcsc.com/datasheet/DSHP04TJGET/5767028.html; Supplier: LCSC; Type: 平拨,凹槽式; Circuit: 单刀单掷; Number of Positions: 4位; Termination Style: J型引脚; Lead Pitch: 1.27mm; Current Rating: 25mA; Voltage Rating: 24V; Operating Temperature: -40℃~+85℃; Operating Life: 3千次; Color: 黑色
U3 = HX811T: 工作电压:1V~6V;复位有效电平:低电平有效;受监控电压数:1;复位超时:500ms;; LCSC Part Name: 检测复位IC  HX811T; Supplier Part: C296128; Manufacturer: HX(恒佳兴); Supplier Footprint: SOT-143; JLCPCB Part Class: 扩展库; Datasheet: https://item.szlcsc.com/datasheet/HX811T/280548.html; Supplier: LCSC; ChipType: 电压监控器; Voltage - Supply: 1V~6V; Reset Active Level: 低电平有效; Threshold Voltage: 3.08V; Number of Voltages Monitored: 1; Manual Reset: 有; Watchdog: 无; Reset Timeout: 500ms; Operating Temperature: -20℃~+70℃@(Ta)
U4 = 93LC56BT-I/OT: The Microchip 93LC56B device is a 2Kb Microwire (3-wire) Serial EEPROM with dedicated 16-bit memory organization and a voltage operation range of 2.5 - 5.5V.? Also available are the 93LC56A for dedicated 8-bit memory organization and the 93LC56C for hardw; Supplier Part: C190271; Manufacturer: MICROCHIP(美国微芯); Supplier Footprint: SOT-23-6; Datasheet: https://atta.szlcsc.com/upload/public/pdf/source/20180423/C190271_ABAD329DACFE2165969EA1B02E3F54C8.pdf; Supplier: LCSC
U5 = TPS7A2033PDBVR: Supplier Part: C2862740; Manufacturer: TI(德州仪器); Supplier Footprint: SOT-23-5; JLCPCB Part Class: 扩展库; Datasheet: https://atta.szlcsc.com/upload/public/pdf/source/20230221/9B73099824E408F4B24BD95C528A27ED.pdf; Supplier: LCSC
U6-U9 = PM254-2-06-W-8.5: 插孔结构:2x6P;间距:2.54mm;行距:2.54mm;圆孔/方孔:方孔;安装类型:弯插;排数:双排;总孔位数:12P;额定电流:3A;额定电压:-;插孔方向:侧面;塑高:8.5mm;工作温度范围:-40℃~+105℃;; LCSC Part Name: 间距:2.54mm 2x6P 弯插; Supplier Part: C2897426; Manufacturer: HCTL(华灿天禄); Supplier Footprint: 弯插,P=2.54mm; JLCPCB Part Class: 扩展库; Datasheet: https://atta.szlcsc.com/upload/public/pdf/source/20230609/283C0D22EF4E6FFE03D5A855876981ED.pdf; Supplier: LCSC; Holes Structure: 2x6P; Pitch: 2.54mm; Row Spacing: 2.54mm; Circular Hole / Square Hole: 方孔; Mounting Type: 弯插; Number of Rows: 双排; Number of Holes: 12P; Current Rating (Max): 3A; Holes Direction: 侧面; Insulation Height: 8.5mm; Operating Temperature Range: -40℃~+105℃
U10 U11 U13 U15 U17 = SN74LVC1T45DPKR: 数据速率:420Mbps;工作电压(VCCA):1.65V~5.5V;工作电压(VCCB):1.65V~5.5V;通道数:1;每个电路通道数:1;; LCSC Part Name: 420Mbps 1位双向电平转换器; Supplier Part: C2677455; Manufacturer: TI(德州仪器); Supplier Footprint: USON-6(1.6x1.6); JLCPCB Part Class: 扩展库; Datasheet: https://www.ti.com/cn/lit/gpn/sn74lvc1t45; Supplier: LCSC; Channel Type: 双向; Data Rate: 420Mbps; Voltage - Supply(VCCA): 1.65V~5.5V; Voltage - Supply(VCCB): 1.65V~5.5V; Number of Circuits: 1; Output Type: 三态; Operating Temperature: -40℃~+85℃
U12 U14 U16 U18 = NCD0603R6: 发光颜色:红色;正向电压(VF):1.6V~2.4V;功率:65mW;正向电流:25mA;主波长:620nm~630nm;透镜颜色:无色透明透镜;发光强度:30mcd~80mcd;发光角度:140°;工作温度:-30℃~+85℃;; Supplier Part: C7429910; Manufacturer: 国星光电; Supplier Footprint: 0603; JLCPCB Part Class: 扩展库; Datasheet: https://atta.szlcsc.com/upload/public/pdf/source/20230620/13EAC00507632A35BC4A697CF03A06D7.pdf; Supplier: LCSC; Emitted Color: 红色; Forward Voltage (VF): 1.6V~2.4V; Power Dissipation: 65mW; Forward Current: 25mA; Dominant Wavelength: 620nm~630nm; Peak Wavelength: 630nm; Lens Color: 无色透明透镜; Luminous Intensity: 30mcd~80mcd; Viewing Angle: 140°; Operating Temperature: -30℃~+85℃
UCN1-UCN3 = FX10A-144S-SV
USB1 = typec: Supplier Part: C9900016956; Supplier Footprint: typec 12p; JLCPCB Part Class: 扩展库; Supplier: LCSC
X1 = TXM12M0004252FBCEO00T: 频率:12MHz;负载电容:12pF;频率公差:±10ppm;; LCSC Part Name: 12MHz ±10ppm 12pF; Supplier Part: C284155; Manufacturer: YJX(雅晶鑫); Supplier Footprint: SMD2520-4P; Datasheet: https://atta.szlcsc.com/upload/public/pdf/source/20180910/C284155_B9AC3CB548367C19CE747B551130DB15.pdf; Supplier: LCSC; Crystal Type: 贴片无源晶振; Load Capacitance: 12pF; Equivalent Series Resistance (ESR): 120Ω; Frequency Tolerance: ±10ppm; Frequency Stability: ±30ppm; Operating Temperature: -40℃~+85℃

## Nets
3V3: C2.2 C3.2 C4.2 C5.2 C7.2 C15.2 L1.1 L2.1 R9.1 R10.1 R13.1 R25.2 U1.20(VCCIO) U1.31(VCCIO) U1.42(VCCIO) U1.50(VREGIN) U1.56(VCCIO) U4.6(VCC) U5.5(OUT)
12V: C16.2 C18.2 CN2.2 UCN3.1 UCN3.2 UCN3.3 UCN3.4 UCN3.5 UCN3.6 ; also on sheet 5
GND: C1.1 C2.1 C3.1 C4.1 C5.1 C6.2 C7.1 C8.1 C9.1 C10.1 C11.2 C12.1 C13.1 C14.2 C15.1 C16.1 C17.1 C18.1 C19.1 C20.1 C21.1 C22.1 C23.1 C24.1 C25.1 C26.2 C27.2 C28.2 C29.2 C30.1 C31.1 C32.1 C33.1 C34.1 C35.1 C36.1 C37.1 C38.1 C39.1 C40.1 C41.1 C42.1 C43.1 C44.1 C45.1 C46.1 C47.1 C48.1 C49.1 C50.1 C51.1 C52.1 C53.1 C54.1 C55.1 C56.1 C57.1 CARD1.6(VSS) CARD1.10 CARD1.11 CARD1.12 CARD1.13 CN1.1 CN1.3 CN1.5 CN1.7 CN1.9 CN1.11 CN1.13 CN2.1 H1.3 L3.2(GND) L3.4(GND) L4.3(GND) L4.4(NC) R5.1 R6.1 R7.1 R8.1 R12.1 R27.1 R28.1 R47.2 R48.2 R52.2 R58.1 R59.2 R60.2 R62.2 R66.2 R67.2 R71.1 R72.2 R73.2 R76.2 R82.1 R83.2 R84.2 R86.2 R92.1 R93.2 R94.2 SW1.2 U1.1(GND) U1.5(GND) U1.10(AGND) U1.11(GND) U1.13(TEST) U1.15(GND) U1.25(GND) U1.35(GND) U1.47(GND) U1.51(GND) U1.65(EP) U3.1(GND) U4.2(VSS) U5.2(GND) U6.3 U6.4 U7.3 U7.4 U8.3 U8.4 U9.3 U9.4 U10.2(GND) U11.2(GND) U12.1(-) U13.2(GND) U14.1(-) U15.2(GND) U16.1(-) U17.2(GND) U18.1(-) U19.1 U19.2 U19.3 U19.4 U20.1 U20.2 U20.3 U20.4 U21.1 U21.2 U21.3 U21.4 U22.1 U22.2 U22.3 U22.4 U49.10(DCOM) U49.14(CLKCOM) U49.19(ACOM) U49.22(ACOM) U49.25(SLEEP) U49.26(DCOM) U49.33(EP) U50.10(DCOM) U50.14(CLKCOM) U50.19(ACOM) U50.22(ACOM) U50.25(SLEEP) U50.26(DCOM) U50.33(EP) U51.10(DCOM) U51.14(CLKCOM) U51.19(ACOM) U51.22(ACOM) U51.25(SLEEP) U51.26(DCOM) U51.33(EP) U52.10(DCOM) U52.14(CLKCOM) U52.19(ACOM) U52.22(ACOM) U52.25(SLEEP) U52.26(DCOM) U52.33(EP) UCN1.13 UCN1.14 UCN1.23 UCN1.24 UCN1.33 UCN1.34 UCN1.43 UCN1.44 UCN1.53 UCN1.54 UCN1.63 UCN1.64 UCN1.73 UCN1.74 UCN1.83 UCN1.84 UCN1.93 UCN1.94 UCN1.103 UCN1.104 UCN1.113 UCN1.114 UCN1.123 UCN1.124 UCN1.133 UCN1.134 UCN1.143 UCN1.144 UCN1.145 UCN1.146 UCN2.13 UCN2.14 UCN2.23 UCN2.24 UCN2.33 UCN2.34 UCN2.43 UCN2.44 UCN2.53 UCN2.54 UCN2.63 UCN2.64 UCN2.73 UCN2.74 UCN2.83 UCN2.84 UCN2.93 UCN2.94 UCN2.103 UCN2.104 UCN2.113 UCN2.114 UCN2.119 UCN2.120 UCN2.125 UCN2.126 UCN2.131 UCN2.132 UCN2.137 UCN2.138 UCN2.143 UCN2.144 UCN2.145 UCN2.146 UCN3.23 UCN3.24 UCN3.33 UCN3.34 UCN3.43 UCN3.44 UCN3.53 UCN3.54 UCN3.63 UCN3.64 UCN3.73 UCN3.74 UCN3.83 UCN3.84 UCN3.93 UCN3.94 UCN3.103 UCN3.104 UCN3.109 UCN3.110 UCN3.115 UCN3.116 UCN3.121 UCN3.122 UCN3.127 UCN3.128 UCN3.133 UCN3.134 UCN3.139 UCN3.140 UCN3.141 UCN3.142 UCN3.143 UCN3.144 UCN3.145 UCN3.146 USB1.1(EP) USB1.2(EP) USB1.3(EP) USB1.4(EP) USB1.A1(GND) USB1.A12(GND) USB1.B1(GND) USB1.B12(GND) X1.2 X1.4 ; also on sheet 4 5
VBAT_IN: UCN1.51
505_CLK0_N: UCN3.107
505_CLK0_P: UCN3.105
505_CLK1_N: UCN3.123
505_CLK1_P: UCN3.125
505_CLK2_N: UCN3.126
505_CLK2_P: UCN3.124
505_CLK3_N: UCN3.108
505_CLK3_P: UCN3.106
505_RX0_N: UCN3.119
505_RX0_P: UCN3.117
505_RX1_N: UCN3.137
505_RX1_P: UCN3.135
505_RX2_N: UCN3.138
505_RX2_P: UCN3.136
505_RX3_N: UCN3.120
505_RX3_P: UCN3.118
505_TX0_N: UCN3.113
505_TX0_P: UCN3.111
505_TX1_N: UCN3.131
505_TX1_P: UCN3.129
505_TX2_N: UCN3.132
505_TX2_P: UCN3.130
505_TX3_N: UCN3.114
505_TX3_P: UCN3.112
ADC1_CLK_N: UCN2.49 ; also on sheet 4
ADC1_CLK_P: UCN2.51 ; also on sheet 4
ADC1_CS: UCN3.39 ; also on sheet 4
ADC1_DCO_N: UCN3.30 ; also on sheet 4
ADC1_DCO_P: UCN3.32 ; also on sheet 4
ADC1_OE: UCN3.41 ; also on sheet 4
ADC1_ORA_N: UCN3.29 ; also on sheet 4
ADC1_ORA_P: UCN3.31 ; also on sheet 4
ADC1_ORB_N: UCN2.42 ; also on sheet 4
ADC1_ORB_P: UCN2.40 ; also on sheet 4
ADC1_OV: R36.2 U11.4(B)
ADC1_SCLK: UCN3.37 ; also on sheet 4
ADC1_SDIO: UCN3.35 ; also on sheet 4
ADC1_SYNC: UCN2.47 ; also on sheet 4
ADC2_CLK_N: UCN2.90 ; also on sheet 4
ADC2_CLK_P: UCN2.92 ; also on sheet 4
ADC2_CS: UCN2.57 ; also on sheet 4
ADC2_DCO_N: UCN2.88 ; also on sheet 4
ADC2_DCO_P: UCN2.86 ; also on sheet 4
ADC2_OE: UCN2.55 ; also on sheet 4
ADC2_ORA_N: UCN2.58 ; also on sheet 4
ADC2_ORA_P: UCN2.56 ; also on sheet 4
ADC2_ORB_N: UCN2.87 ; also on sheet 4
ADC2_ORB_P: UCN2.85 ; also on sheet 4
ADC2_OV: R42.2 U13.4(B)
ADC2_SCLK: UCN2.59 ; also on sheet 4
ADC2_SDIO: UCN2.61 ; also on sheet 4
ADC2_SYNC: UCN2.79 ; also on sheet 4
ADC3_OV: R44.2 U15.4(B)
ADC4_OV: R46.2 U17.4(B)
ADJ_PWR_EN: H2.1 UCN1.1
B43_L1_N: U50.1(DB7) UCN1.129
B43_L1_P: U50.2(DB6) UCN1.131
B43_L2_N: U50.31(DB9) UCN1.125
B43_L2_P: U50.32(DB8) UCN1.127
B43_L3_N: U50.30(DB10) UCN1.121
B43_L3_P: U50.29(DB11) UCN1.119
B43_L4_N: U50.4(DB5) UCN1.135
B43_L4_P: U50.9((LSB)DB0) UCN1.137
B43_L5_N: U50.28(DB12) UCN1.117
B43_L5_P: U50.27(DB13(MSB)) UCN1.115
B43_L6_N: U6.5 UCN1.116
B43_L6_P: U6.6 UCN1.118
B43_L7_N: U50.12(CLK+) UCN1.139
B43_L7_P: U50.13(CLK–) UCN1.141
B43_L8_N: U6.7 UCN1.120
B43_L8_P: U6.8 UCN1.122
B43_L9_N: U50.5(DB4) UCN1.136
B43_L9_P: U50.6(DB3) UCN1.138
B43_L10_N: U50.7(DB2) UCN1.140
B43_L10_P: U50.8(DB1) UCN1.142
B43_L11_N: U6.9 UCN1.126
B43_L11_P: U6.10 UCN1.128
B43_L12_N: U6.11 UCN1.130
B43_L12_P: U6.12 UCN1.132
B44_L1_N: U49.32(DB8) UCN1.97
B44_L1_P: U49.31(DB9) UCN1.95
B44_L2_N: U49.2(DB6) UCN1.101
B44_L2_P: U49.1(DB7) UCN1.99
B44_L3_N: U49.9((LSB)DB0) UCN1.111
B44_L3_P: U49.8(DB1) UCN1.109
B44_L4_N: U49.7(DB2) UCN1.107
B44_L4_P: U49.6(DB3) UCN1.105
B44_L5_N: U49.28(DB12) UCN1.87
B44_L5_P: U49.27(DB13(MSB)) UCN1.85
B44_L6_N: U49.30(DB10) UCN1.91
B44_L6_P: U49.29(DB11) UCN1.89
B44_L7_N: U49.13(CLK–) UCN1.102
B44_L7_P: U49.12(CLK+) UCN1.100
B44_L8_N: U8.5 UCN1.108
B44_L8_P: U8.6 UCN1.106
B44_L9_N: U49.5(DB4) UCN1.88
B44_L9_P: U49.4(DB5) UCN1.86
B44_L10_N: U8.12 UCN1.92
B44_L10_P: U8.11 UCN1.90
B44_L11_N: U8.10 UCN1.98
B44_L11_P: U8.9 UCN1.96
B44_L12_N: U8.7 UCN1.112
B44_L12_P: U8.8 UCN1.110
B45_L1_N: U52.6(DB3) UCN3.60
B45_L1_P: U52.7(DB2) UCN3.62
B45_L2_N: U9.5 UCN3.70
B45_L2_P: U9.6 UCN3.72
B45_L3_N: U52.4(DB5) UCN3.56
B45_L3_P: U52.5(DB4) UCN3.58
B45_L4_N: U52.8(DB1) UCN3.66
B45_L4_P: U52.9((LSB)DB0) UCN3.68
B45_L5_N: U52.1(DB7) UCN3.50
B45_L5_P: U52.2(DB6) UCN3.52
B45_L6_N: U52.31(DB9) UCN3.46
B45_L6_P: U52.32(DB8) UCN3.48
B45_L7_N: U52.28(DB12) UCN3.47
B45_L7_P: U52.27(DB13(MSB)) UCN3.45
B45_L8_N: U52.12(CLK+) UCN3.55
B45_L8_P: U52.13(CLK–) UCN3.57
B45_L9_N: U52.29(DB11) UCN3.49
B45_L9_P: U52.30(DB10) UCN3.51
B45_L10_N: U7.7 UCN3.61
B45_L10_P: U7.8 UCN3.59
B45_L11_N: U7.12 UCN3.69
B45_L11_P: U7.11 UCN3.71
B45_L12_N: U7.9 UCN3.67
B45_L12_P: U7.10 UCN3.65
B46_L1_N: U51.8(DB1) UCN3.99
B46_L1_P: U51.9((LSB)DB0) UCN3.101
B46_L2_N: U51.4(DB5) UCN3.89
B46_L2_P: U51.5(DB4) UCN3.91
B46_L3_N: U51.31(DB9) UCN3.85
B46_L3_P: U51.32(DB8) UCN3.87
B46_L4_N: U51.29(DB11) UCN3.79
B46_L4_P: U51.30(DB10) UCN3.81
B46_L5_N: U51.6(DB3) UCN3.95
B46_L5_P: U51.7(DB2) UCN3.97
B46_L6_N: U51.27(DB13(MSB)) UCN3.75
B46_L6_P: U51.28(DB12) UCN3.77
B46_L7_N: U51.1(DB7) UCN3.76
B46_L7_P: U51.2(DB6) UCN3.78
B46_L8_N: U51.12(CLK+) UCN3.96
B46_L8_P: U51.13(CLK–) UCN3.98
B46_L9_N: U9.12 UCN3.90
B46_L9_P: U9.11 UCN3.92
B46_L10_N: U9.8 UCN3.80
B46_L10_P: U9.7 UCN3.82
B46_L11_N: U9.10 UCN3.86
B46_L11_P: U9.9 UCN3.88
B46_L12_N: U7.6 UCN3.100
B46_L12_P: U7.5 UCN3.102
B65_IO_1U: U15.3(A) UCN2.52
B65_IO_2U: U13.3(A) UCN2.50
B65_IO_3U: U11.3(A) UCN2.48
B65_L1_N: UCN2.105 ; also on sheet 4
B65_L1_P: UCN2.107 ; also on sheet 4
B65_L2_N: UCN2.99 ; also on sheet 4
B65_L2_P: UCN2.101 ; also on sheet 4
B65_L3_N: UCN2.109 ; also on sheet 4
B65_L3_P: UCN2.111 ; also on sheet 4
B65_L4_N: UCN2.97 ; also on sheet 4
B65_L4_P: UCN2.95 ; also on sheet 4
B65_L5_N: UCN2.112 ; also on sheet 4
B65_L5_P: UCN2.110 ; also on sheet 4
B65_L6_N: UCN2.108 ; also on sheet 4
B65_L6_P: UCN2.106 ; also on sheet 4
B65_L7_N: UCN2.96 ; also on sheet 4
B65_L7_P: UCN2.98 ; also on sheet 4
B65_L8_N: UCN2.68 ; also on sheet 4
B65_L8_P: UCN2.66 ; also on sheet 4
B65_L9_N: UCN2.70 ; also on sheet 4
B65_L9_P: UCN2.72 ; also on sheet 4
B65_L10_N: UCN2.60 ; also on sheet 4
B65_L10_P: UCN2.62 ; also on sheet 4
B65_L11_N: UCN2.80 ; also on sheet 4
B65_L11_P: UCN2.82 ; also on sheet 4
B65_L16_N: UCN2.102 ; also on sheet 4
B65_L16_P: UCN2.100 ; also on sheet 4
B65_L17_N: UCN2.89 ; also on sheet 4
B65_L17_P: UCN2.91 ; also on sheet 4
B65_L18_N: UCN2.77
B65_L18_P: UCN2.75
B65_L19_N: UCN2.76 ; also on sheet 4
B65_L19_P: UCN2.78 ; also on sheet 4
B65_L20_N: U10.3(A) UCN2.67
B65_L20_P: UCN2.65
B65_L23_N: UCN2.71
B65_L23_P: UCN2.69
B65_L24_N: U17.3(A) UCN2.81
B66_IO_T1U: UCN3.20
B66_IO_T2U: UCN3.22
B66_IO_T3U: UCN3.18
B66_L1_N: UCN2.41 ; also on sheet 4
B66_L1_P: UCN2.39 ; also on sheet 4
B66_L2_N: UCN2.38 ; also on sheet 4
B66_L2_P: UCN2.36 ; also on sheet 4
B66_L4_N: UCN2.45
B66_L5_N: UCN2.32 ; also on sheet 4
B66_L5_P: UCN2.30 ; also on sheet 4
B66_L6_N: UCN2.31 ; also on sheet 4
B66_L6_P: UCN2.29 ; also on sheet 4
B66_L7_N: UCN2.28 ; also on sheet 4
B66_L7_P: UCN2.26 ; also on sheet 4
B66_L8_N: UCN2.22 ; also on sheet 4
B66_L8_P: UCN2.20 ; also on sheet 4
B66_L9_N: UCN2.18 ; also on sheet 4
B66_L9_P: UCN2.16 ; also on sheet 4
B66_L10_N: UCN3.15 ; also on sheet 4
B66_L10_P: UCN3.17 ; also on sheet 4
B66_L11_N: UCN2.37 ; also on sheet 4
B66_L11_P: UCN2.35 ; also on sheet 4
B66_L14_N: UCN2.21 ; also on sheet 4
B66_L14_P: UCN2.19 ; also on sheet 4
B66_L15_N: UCN2.15 ; also on sheet 4
B66_L15_P: UCN2.17 ; also on sheet 4
B66_L16_N: UCN2.27 ; also on sheet 4
B66_L16_P: UCN2.25 ; also on sheet 4
B66_L17_N: UCN3.28
B66_L17_P: UCN3.26
B66_L18_N: UCN3.42
B66_L18_P: UCN3.40
B66_L19_N: UCN3.19 ; also on sheet 4
B66_L19_P: UCN3.21 ; also on sheet 4
B66_L20_N: UCN3.25 ; also on sheet 4
B66_L20_P: UCN3.27 ; also on sheet 4
B66_L24_N: UCN3.38
B66_L24_P: UCN3.36
CC1: R28.2 USB1.A5(CC1)
CC2: R27.2 USB1.B5(CC2)
DAC1_IOUTA: R52.1 R54.2 U49.21(IOUTA)
DAC1_IOUTB: R56.2 R58.2 U49.20(IOUTB)
DAC2_IOUTA: R62.1 R64.2 U50.21(IOUTA)
DAC2_IOUTB: R68.2 R71.2 U50.20(IOUTB)
DAC3_IOUTA: R76.1 R78.2 U51.21(IOUTA)
DAC3_IOUTB: R81.2 R82.2 U51.20(IOUTB)
DAC4_IOUTA: R86.1 R88.2 U52.21(IOUTA)
DAC4_IOUTB: R90.2 R92.2 U52.20(IOUTB)
DAC_A3V3: C30.2 C31.2 C32.2 C33.2 U49.17(AVDD) U49.18(AVDD) U50.17(AVDD) U50.18(AVDD) U51.17(AVDD) U51.18(AVDD) U52.17(AVDD) U52.18(AVDD) ; also on sheet 5
DAC_AVCC: C42.2 C43.2 C44.2 C45.2 C46.2 C47.2 C48.2 C49.2 U53.8(VCC) U54.8(VCC) U55.8(VCC) U56.8(VCC) ; also on sheet 5
DAC_AVEE: C50.2 C51.2 C52.2 C53.2 C54.2 C55.2 C56.2 C57.2 U53.4(GND) U54.4(GND) U55.4(GND) U56.4(GND) ; also on sheet 5
DAC_D3V3: C34.2 C35.2 C36.2 C37.2 C38.2 C39.2 C40.2 C41.2 R49.2 R51.2 R70.2 R74.2 U49.3(DVDD) U49.11(CLKVDD) U49.15(CMODE) U50.3(DVDD) U50.11(CLKVDD) U50.15(CMODE) U51.3(DVDD) U51.11(CLKVDD) U51.15(CMODE) U52.3(DVDD) U52.11(CLKVDD) U52.15(CMODE) ; also on sheet 5
EE_CLK: R9.2 U1.62(EECLK) U4.4(CLK)
EE_CS: R10.2 U1.63(EECS) U4.5(CS)
EE_DATA: R22.1 R25.1 U1.61(EEDATA) U4.3(DI)
FAN_PWM: CN2.4 U10.4(B)
FPGA_1V8: C21.2 R31.1 R33.1 R39.1 R43.1 R45.1 U10.1(VCCA) U11.1(VCCA) U13.1(VCCA) U15.1(VCCA) U17.1(VCCA) UCN3.7 UCN3.8 UCN3.9 UCN3.10 ; also on sheet 5
FPGA_3V3: C1.2 C11.1 C17.2 C19.2 C20.2 C22.2 C23.2 C24.2 C25.2 CARD1.4(VDD) CN1.2 R1.2 R2.2 R3.2 R4.2 R11.2 R14.2 R15.2 R16.2 R17.2 R18.2 R20.2 U3.4(VCC) U6.1 U6.2 U7.1 U7.2 U8.1 U8.2 U9.1 U9.2 U10.6(VCCB) U11.6(VCCB) U13.6(VCCB) U15.6(VCCB) U17.6(VCCB) UCN1.6 UCN1.8 UCN1.10 UCN1.12 UCN3.11 UCN3.12 UCN3.13 UCN3.14 ; also on sheet 5
FPGA_TCK: R37.2 R38.2 UCN2.9
FPGA_TDI: R30.2 R32.2 UCN2.5
FPGA_TDO: R34.2 R35.2 UCN2.7
FPGA_TMS: R40.2 R41.2 UCN2.11
GT224_CLK0_N: UCN2.140
GT224_CLK0_P: UCN2.142
GT224_CLK1_N: UCN2.139
GT224_CLK1_P: UCN2.141
GT224_RX0_N: UCN2.134
GT224_RX0_P: UCN2.136
GT224_RX1_N: UCN2.128
GT224_RX1_P: UCN2.130
GT224_RX2_N: UCN2.116
GT224_RX2_P: UCN2.118
GT224_RX3_N: UCN2.122
GT224_RX3_P: UCN2.124
GT224_TX0_N: UCN2.133
GT224_TX0_P: UCN2.135
GT224_TX1_N: UCN2.127
GT224_TX1_P: UCN2.129
GT224_TX2_N: UCN2.115
GT224_TX2_P: UCN2.117
GT224_TX3_N: UCN2.121
GT224_TX3_P: UCN2.123
JTAG_TCK: R37.1 U1.16(ADBUS0)
JTAG_TDI: R30.1 U1.17(ADBUS1)
JTAG_TDO: R34.1 U1.18(ADBUS2)
JTAG_TMS: R40.1 U1.19(ADBUS3)
LOGIC_5V: R29.2 ; also on sheet 5
PJTAG_TCK: R23.2 R38.1
PJTAG_TDI: R26.2 R32.1
PJTAG_TDO: R24.2 R35.1
PJTAG_TMS: R21.2 R41.1
PS_MODE0: R1.1 U2.8 UCN2.12
PS_MODE1: R2.1 U2.7 UCN2.10
PS_MODE2: R3.1 U2.6 UCN2.8
PS_MODE3: R4.1 U2.5 UCN2.6
PS_POR_B: R11.1 U3.2(RESET#) UCN1.5
PS_UART1_RX: H1.2 UCN1.71
PS_UART1_TX: H1.1 UCN1.69
PS_UART_RX: U1.38(BDBUS0) UCN1.48
PS_UART_TX: U1.39(BDBUS1) UCN1.46
PWR_EN: H2.2 ; also on sheet 5
SD_CD: R19.1 R20.1 UCN1.35
SD_CLK: CARD1.5(CLX) UCN1.41
SD_CMD: CARD1.3(CMD) R16.1 UCN1.45
SD_D0: CARD1.7(DAT0) R17.1 UCN1.39
SD_D1: CARD1.8(DAT1) R18.1 UCN1.37
SD_D2: CARD1.1(DAT2) R14.1 UCN1.49
SD_D3: CARD1.2(CD/DAT3) R15.1 UCN1.47
USB_5V: L3.3(OUT) U5.3(EN) USB1.A4(VBUS) USB1.A9(VBUS) USB1.B4(VBUS) USB1.B9(VBUS)
USB_DN: L4.5(D-) USB1.A7(DN1) USB1.B7(DN2)
USB_DN_O: L4.2(D-) U1.7(DM)
USB_DP: L4.6(D+) USB1.A6(DP1) USB1.B6(DP2)
USB_DP_O: L4.1(D+) U1.8(DP)
VCORE: C6.1 C8.2 C9.2 C10.2 U1.12(VCORE) U1.37(VCORE) U1.49(VREGOUT) U1.64(VCORE)
$2N15831: SW1.1 U3.3(MR#)
$2N16113: R5.2 U2.1
$2N16115: R6.2 U2.2
$2N16117: R7.2 U2.3
$2N16119: R8.2 U2.4
$2N19335: CN1.4 R21.1
$2N19337: CN1.6 R23.1
$2N19339: CN1.8 R24.1
$2N19341: CN1.10 R26.1
$2N19800: H2.3 R29.1
$2N26738: R33.2 U11.5(DIR)
$2N26832: R39.2 U13.5(DIR)
$2N26925: R43.2 U15.5(DIR)
$2N27018: R45.2 U17.5(DIR)
$2N27100: R46.1 U18.2(+)
$2N27189: R44.1 U16.2(+)
$2N27276: R42.1 U14.2(+)
$2N27364: R36.1 U12.2(+)
$2N30823: L1.2 U1.4(VPHY)
$2N30824: L2.2 U1.9(VPLL)
$2N30831: R12.2 U1.6(REF)
$2N30833: R13.2 U1.14(RESET#)
$2N30847: C12.2 U1.3(OSCO) X1.3(OSC2)
$2N30848: C13.2 U1.2(OSCI) X1.1(OSC1)
$2N30857: R22.2 U4.1(DO)
$2N35046: C14.1 L3.1(IN) U5.1(IN)
$2N35631: R31.2 U10.5(DIR)
$3N3212: R49.1 U49.16(MODE)
$3N3265: R47.1 U49.24(FSADJ)
$3N3335: C26.1 U49.23(REFIO)
$3N4191: R56.1 R59.1 U53.3(IN1+)
$3N4195: R50.2 R54.1 U53.2(IN1-)
$3N4610: R50.1 R55.2 U53.1(OUT1)
$3N4665: R53.2 R55.1 U53.6(IN2-)
$3N4679: R53.1 R57.1 U53.7(OUT2)
$3N4852: R57.2 U19.5
$3N6680: R51.1 U50.16(MODE)
$3N6687: R48.1 U50.24(FSADJ)
$3N6689: C27.1 U50.23(REFIO)
$3N6701: R68.1 R72.1 U54.3(IN1+)
$3N6708: R61.2 R64.1 U54.2(IN1-)
$3N6713: R61.1 R65.2 U54.1(OUT1)
$3N6717: R63.2 R65.1 U54.6(IN2-)
$3N6720: R63.1 R69.1 U54.7(OUT2)
$3N6730: R69.2 U20.5
$3N7148: R74.1 U51.16(MODE)
$3N7155: R66.1 U51.24(FSADJ)
$3N7157: C29.1 U51.23(REFIO)
$3N7529: R70.1 U52.16(MODE)
$3N7536: R67.1 U52.24(FSADJ)
$3N7538: C28.1 U52.23(REFIO)
$3N9780: R81.1 R83.1 U55.3(IN1+)
$3N9784: R75.2 R78.1 U55.2(IN1-)
$3N9787: R75.1 R79.2 U55.1(OUT1)
$3N9788: R77.2 R79.1 U55.6(IN2-)
$3N9789: R77.1 R80.1 U55.7(OUT2)
$3N9794: R80.2 U21.5
$3N9797: R90.1 R93.1 U56.3(IN1+)
$3N9801: R85.2 R88.1 U56.2(IN1-)
$3N9804: R85.1 R89.2 U56.1(OUT1)
$3N9805: R87.2 R89.1 U56.6(IN2-)
$3N9806: R87.1 R91.1 U56.7(OUT2)
$3N9811: R91.2 U22.5
$3N22919: R73.1 U54.5(IN2+)
$3N22945: R60.1 U53.5(IN2+)
$3N22971: R84.1 U55.5(IN2+)
$3N22997: R94.1 U56.5(IN2+)
Net-(CARD1-CD): CARD1.CD R19.2

Not connected (* = marked no-connect by the designer): CN1 12* 14*; CN2 3*; U1 21(ADBUS4) 22(ADBUS5) 23(ADBUS6) 24(ADBUS7) 26(ACBUS0) 27(ACBUS1) 28(ACBUS2) 29(ACBUS3) 30(ACBUS4) 32(ACBUS5) 33(ACBUS6) 34(ACBUS7) 36(SUSPEND#) 40(BDBUS2) 41(BDBUS3) 43(BDBUS4) 44(BDBUS5) 45(BDBUS6) 46(BDBUS7) 48(BCBUS0) 52(BCBUS1) 53(BCBUS2) 54(BCBUS3) 55(BCBUS4) 57(BCBUS5) 58(BCBUS6) 59(BCBUS7) 60(PWREN#); U5 4(NC)*; UCN1 2* 3* 4* 7* 9* 11* 15* 16* 17* 18* 19* 20* 21* 22* 25* 26* 27* 28* 29* 30* 31* 32* 36* 38* 40* 42* 50* 52* 55* 56* 57* 58* 59* 60* 61* 62* 65* 66* 67* 68* 70* 72* 75* 76* 77* 78* 79* 80* 81* 82*; UCN2 1* 2* 3* 4* 46*; UCN3 16*; USB1 A8(SBU1)* B8(SBU2)*

## Notes on the sheets
sheet 1
- FPGA PINOUT
- PMOD1
- PMOD2
- OR LED ADC1-4
  K5 P9 H2 H8
- L14  L13
  A10  B11
  C12  D12
  A12  A11
- AD12  AC12
  AC11  AB11
  AA8   Y9
  AB9   AB10
- K12  K13
  H14  H13
  K14  J14
  G15  G14
- AB14  AB15
  AA12  Y12
  W12   W11
  Y14   Y13
- FAN PWM H6
- DAC1
  CLKP-N D0-13
- DAC2
  CLKP-N D0-13
- DAC3
  CLKP-N D0-13
- DAC4
  CLKP-N D0-13
- AA13 AB13
  AH13 AG13
  AF13 AE13
  W13  W14
  AH14 AG14
  AE14 AE15
  AC13 AC14
  AD14 AD15
- AD10 AD11
  AE10 W10
  Y10  AA11
  AA10 AF10
  AG10 AH10
  AF11 AG11
  AH11 AH12
  AF12 AE12
- E15 F15
  B15 A15
  D15 D14
  B14 A14
  G13 F13
  B13 A13
  C14 C13
  E14 E13
- D11 E12
  J12 H12
  J11 J10
  H11 G10
  G11 F10
  F12 F11
  C11 B10
  D10 E10
- ADC1 DATA	FPGA _P
- ADC2 DATA	FPGA _P
- D0	E1
  D1	E4
  D2	C1
  D3	A2
  D4	B3
  D5	G1
  D6	D4
  D7	B4
  D8	B5
  D9	C6
  D10	G5
  D11	G8
  D12	E5
  D13N	G6
- CLKN	C3
  DCON	D7
  ORA	A7
  ORBN	F2
- D0	R7
  D1	R6
  D2	P7
  D3N	L1
  D4N	U8
  D5N	W8
  D6N	U9
  D7	R8
  D8N	N9
  D9N	K4
  D10N	J5
  D11N	K2
  D12	J1
  D13N	H4
- CLKN	L3
  DCON	M6
  ORAN	J7
  ORB	N7
- SYNC	G3
  SDIO	B8
  SCLK	C8
  CS	A8
  OE	A9
- SYNC	H9
  SDIO	L6
  SCLK	L7
  CS	K8
  OE	K7
sheet 2
- BOOT MODE
- PS RST
- MIO32 33
- SD CARD
- USB TO JTAG&UART
- JTAG UART
- PWR_EN IS 5V
- POWER EN SELECT
- USB TYPEC & FILTER
- PMOD
- FANS
- JTAG SELECT
- FPGA used Alientek MPSoC XCZU4EV Core Board
- ADC OVER RANGE
sheet 3
- Vfsadj = 1.2V
  Iout = 32*（Vfsadj /R）
  R=2k Imax = 19.2mA
- Vfsadj = 1.2V
  Iout = 32*（Vfsadj /R）
  R=2k Imax = 19.2mA
